# EAGLE board EbookReader (EAGLE 9.7.0)
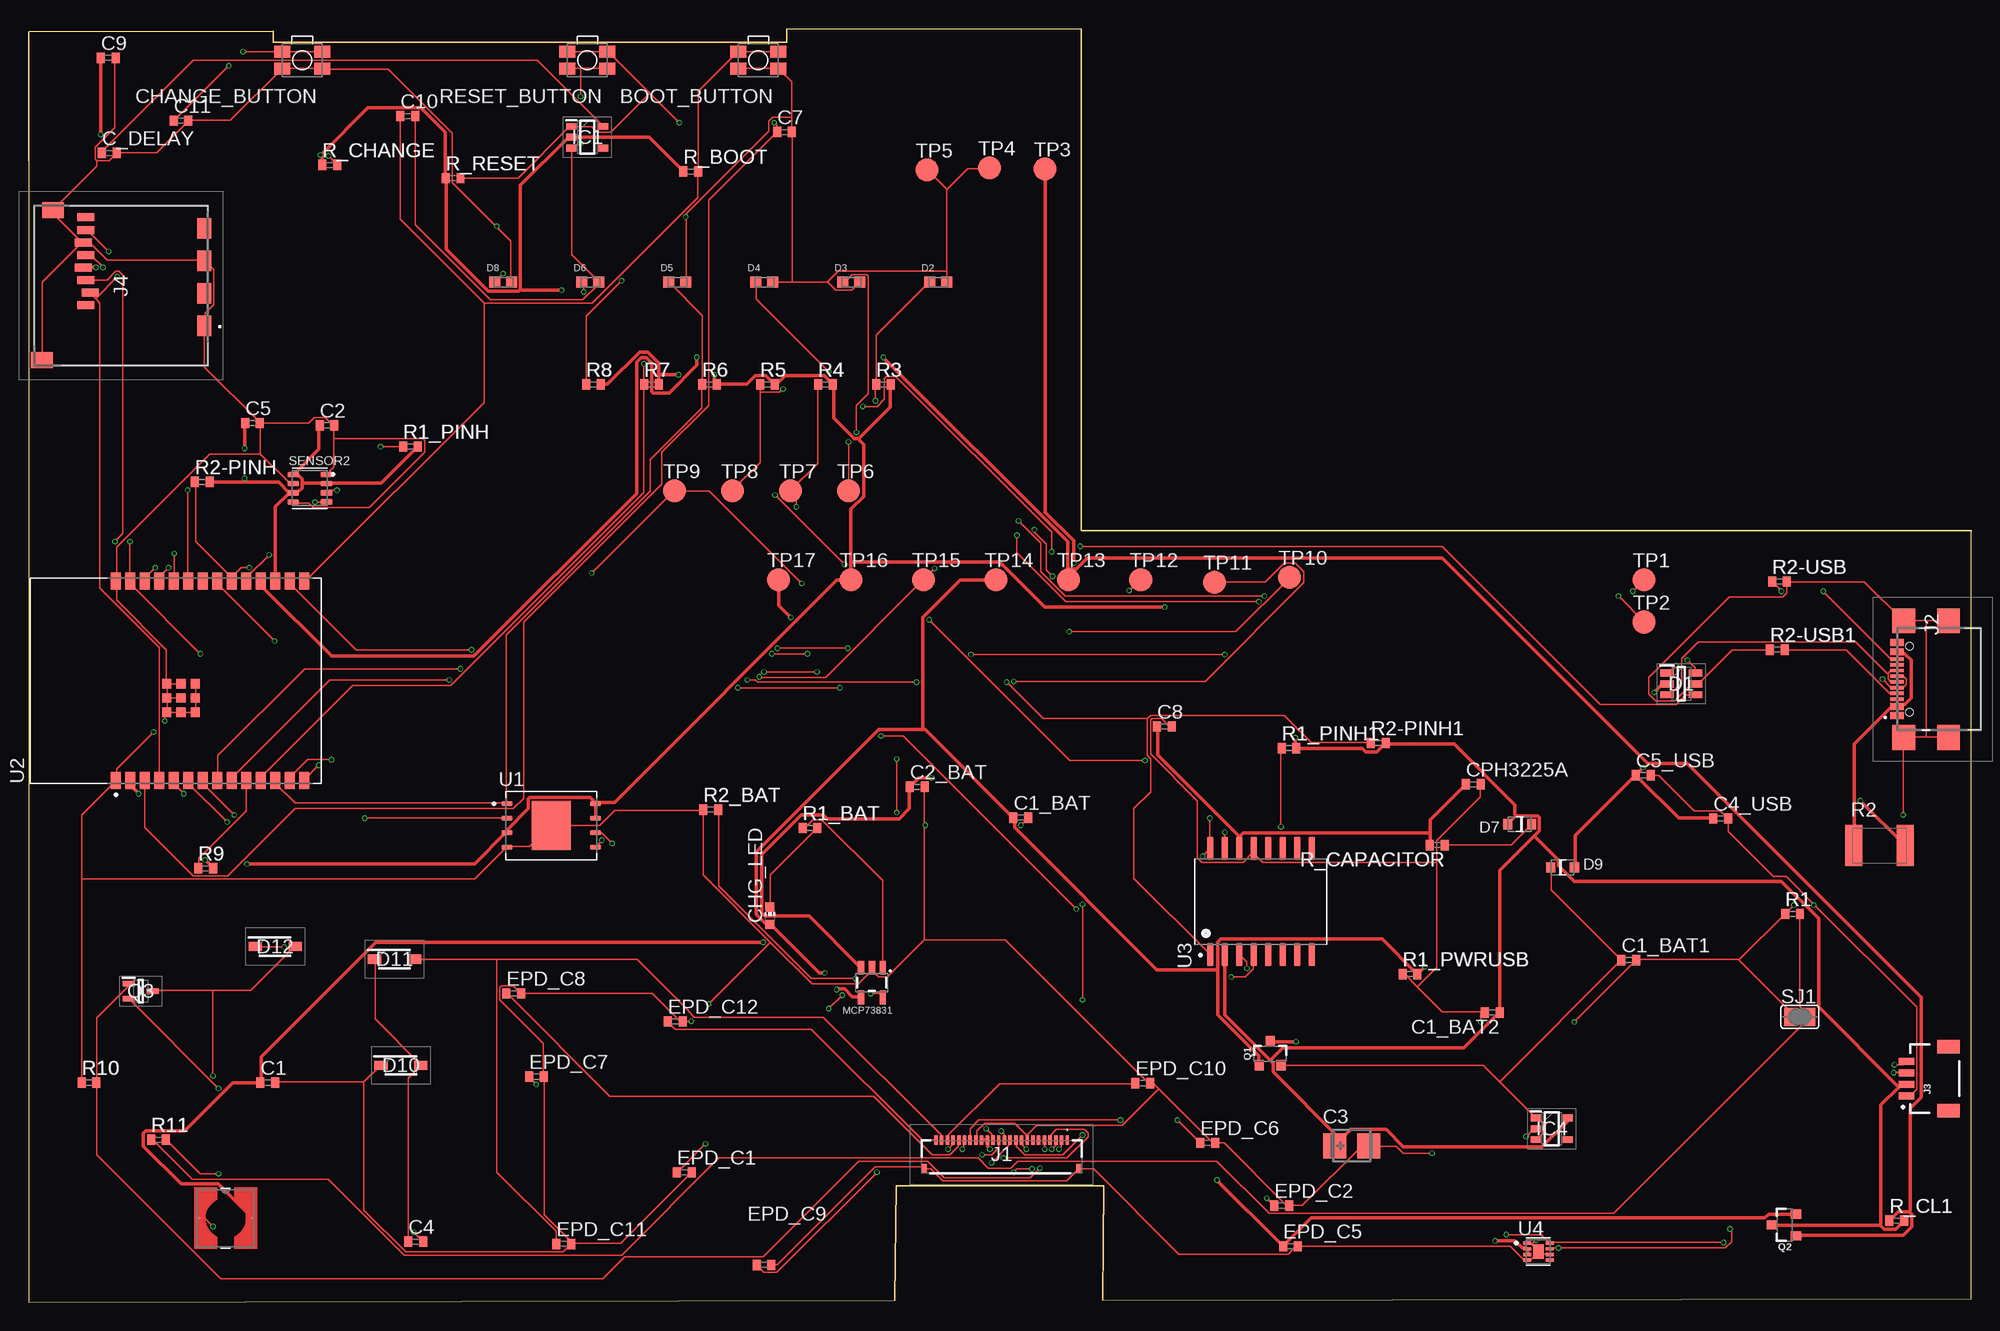
[diagram p1: board, top side]
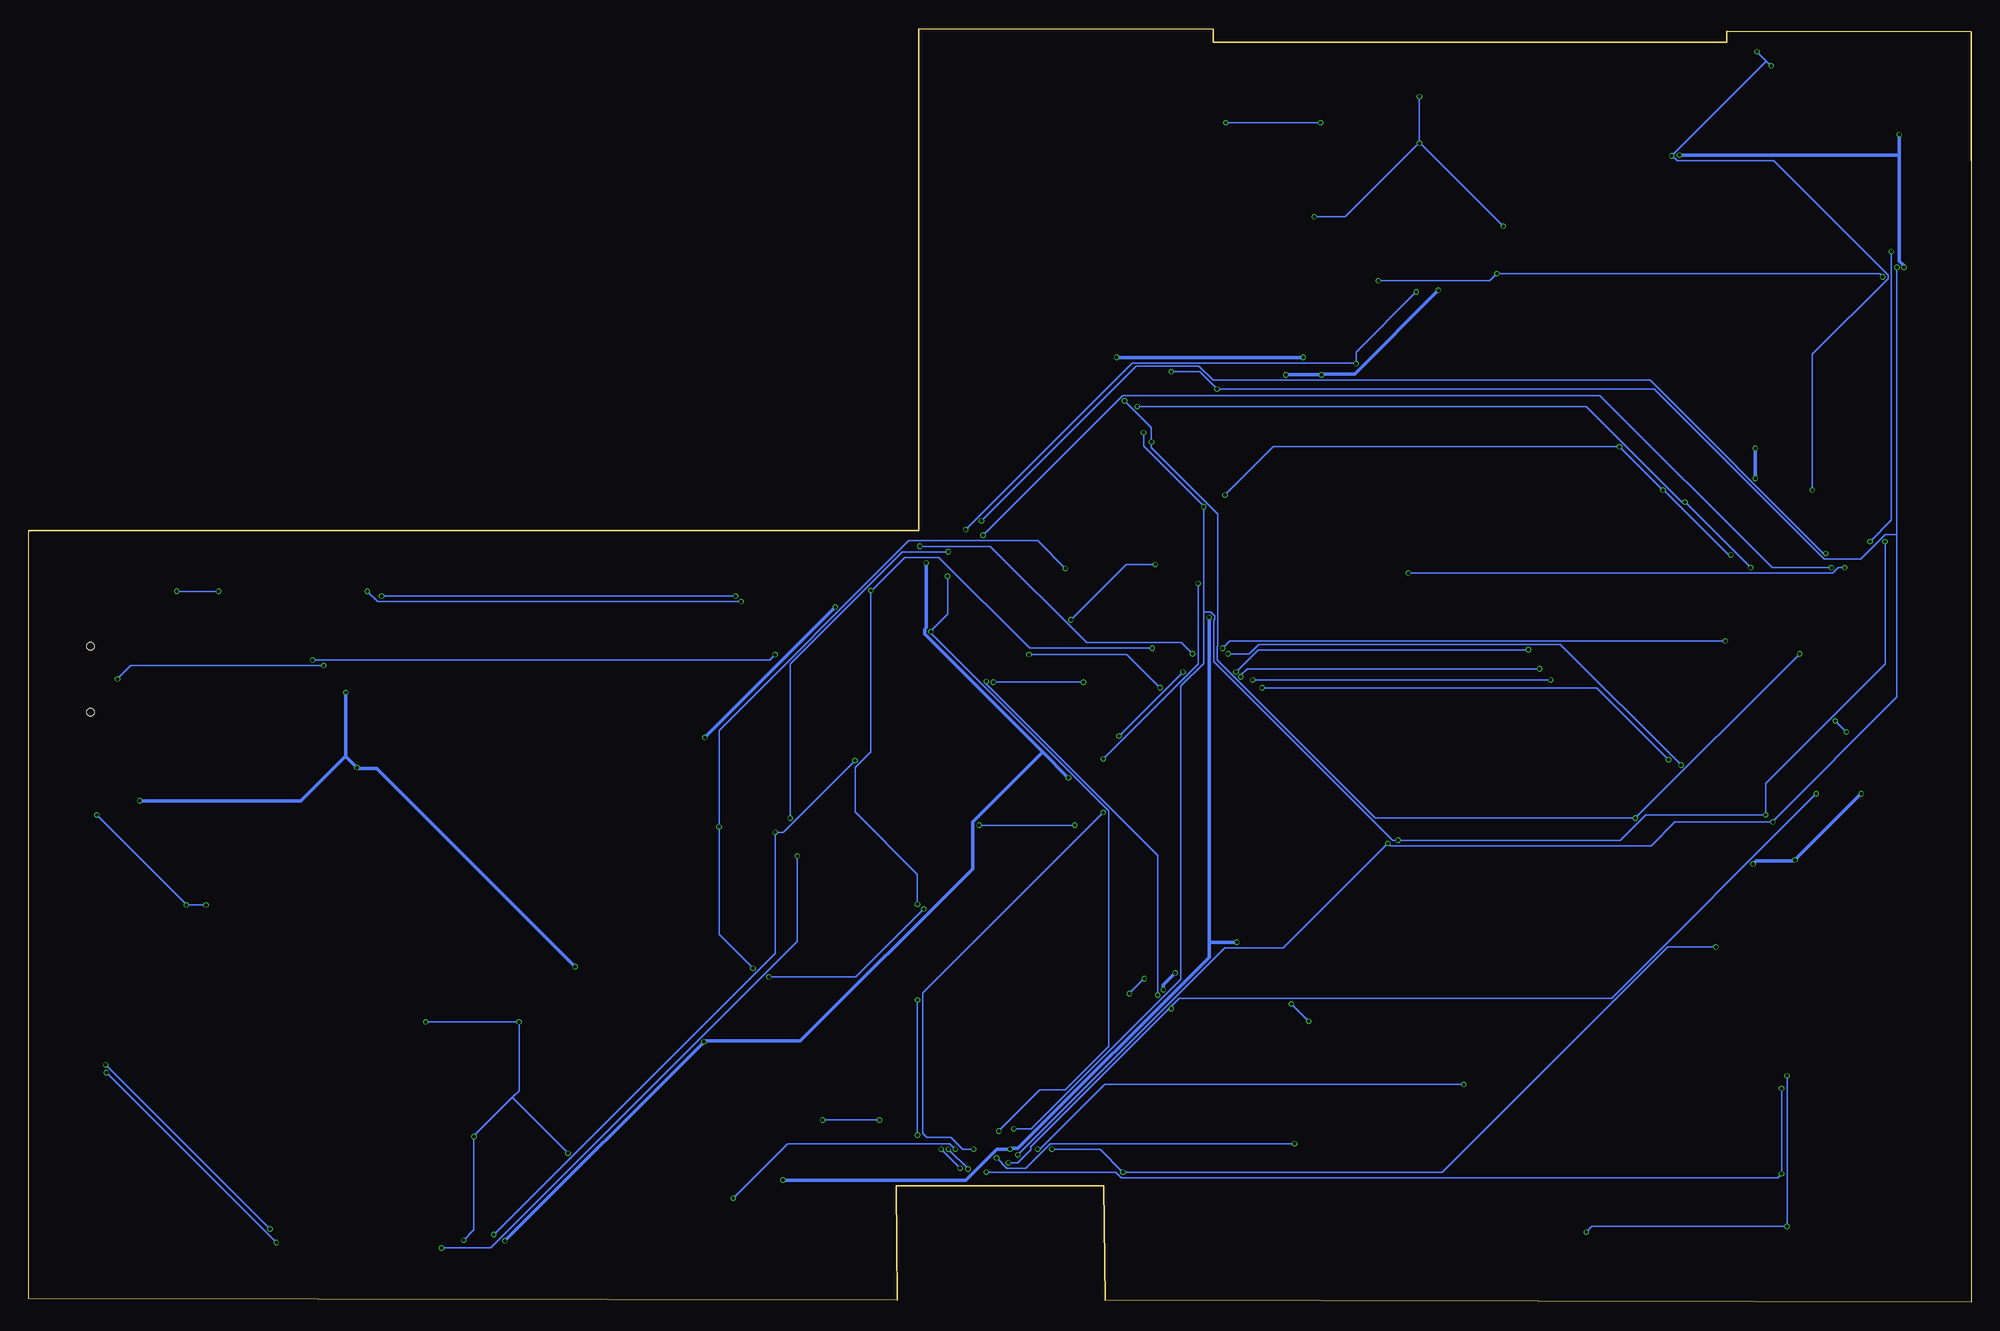
[diagram p2: board, bottom side, seen from below]

Size 170.2 x 111.6 mm. Coordinates in mm from the lower left corner, seen from the top.
Outline: 0,0 75.9,0.13 76,10.2 94.19,10.2 94.09,0.17 170.2,0.3 170.2,67.5 170.2,67.6 92.2,67.6 92.2,111.6 66.41,111.52 66.41,110.4 21.45,110.4 21.45,111.37 0,111.3 0,100 0,0
Copper layers (1*16): Top 0.035mm / dielectric 1.6mm / Bottom 0.035mm
Design rules "jlcpcb-2layers.dru": minimum track width 0.15mm, minimum drill 0.3mm, track to track 5mil, track to pad 5mil, pad to pad 5mil, via to via 5mil, smd to smd 5mil, copper to edge 0.2mm, drill to drill 6mil, minimum pad ring 10mil, minimum via ring 3mil, stop-mask expansion 4mil, vias tented up to drill 0mil, thermal gap 10mil
Net classes: 1 Power: width 0.15 mm

## Footprints (pad centres in the part's own frame; a part is rotated, then mirrored left to right if it is on the bottom)
MYBUTTON = smd 1.4 x 1.05: 1 1.75,0.75; 2 -1.75,0.75; 3 -1.75,-0.75; 4 1.75,-0.75
ESP32_WROVER_EAGLE-LTSPICE_C0402 = smd 0.7 x 0.9: 1 -0.65,0; 2 0.65,0
RCL_CT3528 = smd 2 x 2.2: + -1.5,0; - 1.5,0
EAGLE-LTSPICE_C0402 = smd 0.7 x 0.9: 1 -0.65,0; 2 0.65,0
ADAFRUIT_CHIP-LED0603 = smd 0.8 x 0.8: A 0,-0.75; C 0,0.75
SOT95P280X145-6N = smd 1.2 x 0.6: 1 -1.25,0.95; 2 -1.25,0; 3 -1.25,-0.95; 4 1.25,-0.95; 5 1.25,0; 6 1.25,0.95
DIOC1608X36N = smd 0.97 x 0.94: 1 -0.75,0; 2 0.75,0
ESP32_WROVER_AVX---SD0805S020S1R0_AVX_SD0805S020S1R0_0 = smd 0.8 x 0.9: 1 -1.05,0; 2 1.05,0
SOD3716X135N = smd 1.15 x 0.8: 1 -1.75,0; 2 1.75,0
SOT95P280X125-5N = smd 0.9 x 0.6: 1 -1.4,0.95; 2 -1.4,0; 3 -1.4,-0.95; 4 1.4,-0.95; 5 1.4,0.95
SOT95P280X120-5N = smd 0.9 x 0.6: 1 -1.4,0.95; 2 -1.4,0; 3 -1.4,-0.95; 4 1.4,-0.95; 5 1.4,0.95
FH34SRJ24S05SH99 = smd 0.3 x 0.8: 1 5.75,1.45; 2 5.25,1.45; 3 4.75,1.45; 4 4.25,1.45; 5 3.75,1.45; 6 3.25,1.45; 7 2.75,1.45; 8 2.25,1.45; 9 1.75,1.45; 10 1.25,1.45; 11 0.75,1.45; 12 0.25,1.45; 13 -0.25,1.45; 14 -0.75,1.45; 15 -1.25,1.45; 16 -1.75,1.45; 17 -2.25,1.45; 18 -2.75,1.45; 19 -3.25,1.45; 20 -3.75,1.45; 21 -4.25,1.45; 22 -4.75,1.45; 23 -5.25,1.45; 24 -5.75,1.45 | smd 0.4 x 0.8: MP1 6.75,-1.05; MP2 -6.75,-1.05
SAMACSYS_PARTS_USB4110GFA = smd 0.3 x 1.15: A1 -3.35,3.678; A4 -2.55,3.678; A5 -1.25,3.678; A6 -0.25,3.678; A7 0.25,3.678; A8 1.25,3.678; A9 2.55,3.678; A12 3.35,3.678; B1 3.05,3.678; B4 2.25,3.678; B5 1.75,3.678; B6 0.75,3.678; B7 -0.75,3.678; B8 -1.75,3.678; B9 -2.25,3.678; B12 -3.05,3.678 | smd 2.18 x 2: MP1 -5.11,-0.827; MP2 5.11,-0.827; MP3 -5.11,3.103; MP4 5.11,3.103 | hole 0.65: -2.89,2.603; 2.89,2.603
JST04_1MM_RA = smd 0.6 x 1.35: 1 -1.5,0; 2 -0.5,0; 3 0.5,0; 4 1.5,0 | smd 1.2 x 2: NC1 2.8,-3.675; NC2 -2.8,-3.675
112ATAARR03ATTEND = smd 1.8 x 1.2: G1 10.6,10.4; G2 4.9,10.4; S1 7.75,10.4; S2 2.05,10.4 | smd 1.4 x 1.9: G3 13.6,-3.85; G4 0.45,-2.85 | smd 0.7 x 1.5: P1 8.8,0; P2 7.7,0.4; P3 6.6,0; P4 5.5,-0.2; P5 4.4,0; P6 3.3,-0.2; P7 2.2,0; P8 1.1,0
IND_4828-WE-TPC_WRE = smd 0.127 x 0.127: 1 -2.286,0; 2 2.286,0
ESP32_WROVER_SPARKFUN-IC-POWER_SOT23-5 = smd 0.55 x 1.2: 1 -0.95,-1.3; 2 0,-1.3; 3 0.95,-1.3; 4 0.95,1.3; 5 -0.95,1.3
ESP32_WROVER_SPARKFUN-DISCRETESEMI_SOT23-3 = smd 0.8 x 0.9: 1 -0.95,-1; 2 0.95,-1; 3 0,1.1
SOT65P210X110-3N = smd 1.05 x 0.5: 1 -1.05,0.65; 2 -1.05,-0.65; 3 1.05,0
ESP32_WROVER_EAGLE-LTSPICE_R0402 = smd 0.7 x 0.9: 1 -0.65,0; 2 0.65,0
ESP32C6_VARISTOR_CT/CN1812 = smd 1.5 x 3.6: 1 -2.25,0; 2 2.25,0
ESP32_WROVER_BME680_PSON80P300X300X100-8N = smd 1.016 x 0.5: 1 1.458,1.2; 2 1.458,0.4; 3 1.458,-0.4; 4 1.458,-1.2; 5 -1.458,-1.22; 6 -1.458,-0.4; 7 -1.458,0.4; 8 -1.458,1.2
SJ = smd 1.168 x 1.6: 1 -0.762,0; 2 0.762,0
TP20R = smd 2 x 2: TP 0,0
SON127P600X800X80-9N = smd 0.94 x 0.44: 1 -3.895,1.905; 2 -3.895,0.635; 3 -3.895,-0.635; 4 -3.895,-1.905; 5 3.895,-1.905; 6 3.895,-0.635; 7 3.895,0.635; 8 3.895,1.905 | smd 3.4 x 4.3: 9 0,0
XCVR_ESP32-C6-WROOM-1-N8 = smd 1.5 x 0.9: 1 -8.75,5.26; 2 -8.75,3.99; 3 -8.75,2.72; 4 -8.75,1.45; 5 -8.75,0.18; 6 -8.75,-1.09; 7 -8.75,-2.36; 8 -8.75,-3.63; 9 -8.75,-4.9; 10 -8.75,-6.17; 11 -8.75,-7.44; 12 -8.75,-8.71; 13 -8.75,-9.98; 14 -8.75,-11.25; 15 8.75,-11.25; 16 8.75,-9.98; 17 8.75,-8.71; 18 8.75,-7.44; 19 8.75,-6.17; 20 8.75,-4.9; 21 8.75,-3.63; 22 8.75,-2.36; 23 8.75,-1.09; 24 8.75,0.18; 25 8.75,1.45; 26 8.75,2.72; 27 8.75,3.99; 28 8.75,5.26 | smd 0.8 x 0.8: 29_1 -2.755,0.79; 29_2 -1.505,0.79; 29_3 -0.255,0.79; 29_4 -2.755,-0.46; 29_5 -1.505,-0.46; 29_6 -0.255,-0.46; 29_7 -2.755,-1.71; 29_8 -1.505,-1.71; 29_9 -0.255,-1.71
SOIC127P1032X265-16N = smd 2.05 x 0.59: 1 -4.655,4.445; 2 -4.655,3.175; 3 -4.655,1.905; 4 -4.655,0.635; 5 -4.655,-0.635; 6 -4.655,-1.905; 7 -4.655,-3.175; 8 -4.655,-4.445; 9 4.655,-4.445; 10 4.655,-3.175; 11 4.655,-1.905; 12 4.655,-0.635; 13 4.655,0.635; 14 4.655,1.905; 15 4.655,3.175; 16 4.655,4.445
SON50P200X200X80-9N = smd 0.76 x 0.27: 1 -0.985,0.75; 2 -0.985,0.25; 3 -0.985,-0.25; 4 -0.985,-0.75; 5 0.985,-0.75; 6 0.985,-0.25; 7 0.985,0.25; 8 0.985,0.75 | smd 0.9 x 1.3: 9 0,0

## Placement (x,y rotation side)
BOOT_BUTTON  BUTTON_CUSYOMV1  [MYBUTTON]  63.94,108.83 180 top
C1  10uF  [ESP32_WROVER_EAGLE-LTSPICE_C0402]  20.96,19.23 0 top
C1_BAT  4.7uF  [ESP32_WROVER_EAGLE-LTSPICE_C0402]  86.93,42.45 0 top
C1_BAT1  4.7uF  [ESP32_WROVER_EAGLE-LTSPICE_C0402]  140.18,29.97 0 top
C1_BAT2  4.7uF  [ESP32_WROVER_EAGLE-LTSPICE_C0402]  128.22,25.37 180 top
C2  100nF  [ESP32_WROVER_EAGLE-LTSPICE_C0402]  26.14,76.83 0 top
C2_BAT  4.7uF  [ESP32_WROVER_EAGLE-LTSPICE_C0402]  77.84,45.15 0 top
C3  100uF TANT  [RCL_CT3528]  115.91,13.7 0 top
C4  4.7uF/25V  [ESP32_WROVER_EAGLE-LTSPICE_C0402]  33.91,5.29 0 top
C4_USB  100nF  [ESP32_WROVER_EAGLE-LTSPICE_C0402]  148.23,42.37 0 top
C5  100nF  [ESP32_WROVER_EAGLE-LTSPICE_C0402]  19.62,77.03 0 top
C5_USB  4.7uF  [ESP32_WROVER_EAGLE-LTSPICE_C0402]  141.44,46.17 0 top
C7  1uF  [ESP32_WROVER_EAGLE-LTSPICE_C0402]  66.22,102.53 0 top
C8  100nF  [EAGLE-LTSPICE_C0402]  99.5,50.43 0 top
C9  100nF  [ESP32_WROVER_EAGLE-LTSPICE_C0402]  6.98,109.03 0 top
C10  100nf  [ESP32_WROVER_EAGLE-LTSPICE_C0402]  33.21,103.93 0 top
C11  100nF  [ESP32_WROVER_EAGLE-LTSPICE_C0402]  13.36,103.53 0 top
C_DELAY  100nF  [ESP32_WROVER_EAGLE-LTSPICE_C0402]  7.07,100.69 0 top
CHANGE_BUTTON  BUTTON_CUSYOMV1  [MYBUTTON]  23.98,108.83 180 top
CHG_LED  [ADAFRUIT_CHIP-LED0603]  64.94,33.85 0 top
CPH3225A  [EAGLE-LTSPICE_C0402]  126.55,45.37 0 top
D1  USBLC6-2SC6Y  [SOT95P280X145-6N]  144.78,54.17 0 top
D2  PGB1010603MR  [DIOC1608X36N]  79.68,89.37 0 top
D3  PGB1010603MR  [DIOC1608X36N]  72.06,89.37 0 top
D4  PGB1010603MR  [DIOC1608X36N]  64.44,89.37 0 top
D5  PGB1010603MR  [DIOC1608X36N]  56.82,89.37 0 top
D6  PGB1010603MR  [DIOC1608X36N]  49.2,89.37 0 top
D7  ESP32_WROVER_AVX---SD0805S020S1R0_AVX_SD0805S020S1R0_0_0AVX_SD0805S020S1R0_0_0  [ESP32_WROVER_AVX---SD0805S020S1R0_AVX_SD0805S020S1R0_0]  130.63,41.88 180 top
D8  PGB1010603MR  [DIOC1608X36N]  41.58,89.37 0 top
D9  ESP32_WROVER_AVX---SD0805S020S1R0_AVX_SD0805S020S1R0_0_0AVX_SD0805S020S1R0_0_0  [ESP32_WROVER_AVX---SD0805S020S1R0_AVX_SD0805S020S1R0_0]  134.38,38.08 0 top
D10  MBR0530  [SOD3716X135N]  32.62,20.75 0 top
D11  MBR0530  [SOD3716X135N]  32.06,30.05 0 top
D12  MBR0530  [SOD3716X135N]  21.6,31.15 0 top
EPD_C1  1uF/50V  [EAGLE-LTSPICE_C0402]  57.45,11.37 0 top
EPD_C2  1uF/50V  [EAGLE-LTSPICE_C0402]  109.78,8.45 0 top
EPD_C5  0.1uF/50V  [EAGLE-LTSPICE_C0402]  110.55,4.89 0 top
EPD_C6  1uF/50V  [EAGLE-LTSPICE_C0402]  103.29,13.95 0 top
EPD_C7  1uF/50V  [EAGLE-LTSPICE_C0402]  44.5,19.75 0 top
EPD_C8  1uF/50V  [EAGLE-LTSPICE_C0402]  42.51,27.05 0 top
EPD_C9  1uF/50V  [EAGLE-LTSPICE_C0402]  64.42,3.25 0 top
EPD_C10  1uF/50V  [EAGLE-LTSPICE_C0402]  97.61,19.19 0 top
EPD_C11  1uF/50V  [EAGLE-LTSPICE_C0402]  46.89,5.09 0 top
EPD_C12  1uF/50V  [EAGLE-LTSPICE_C0402]  56.65,24.59 0 top
IC1  BD5229G-TR  [SOT95P280X125-5N]  48.95,102.07 0 top
IC4  XC6220A331MR-G  [SOT95P280X120-5N]  133.43,15.19 0 top
J1  FH34SRJ-24S-0.5SH_99_  [FH34SRJ24S05SH99]  85.24,12.74 0 top
J2  SAMACSYS_PARTS_USB4110-GF-A  [SAMACSYS_PARTS_USB4110GFA]  167.36,54.59 90 top
J3  QWIIC_RIGHT_ANGLE  [JST04_1MM_RA]  164.51,19.58 90 top
J4  112A-TAAR-R03_ATTEND  [112ATAARR03ATTEND]  5,96.15 270 top
L1  68uH  [IND_4828-WE-TPC_WRE]  17.27,7.35 0 top
MCP73831  ESP32_WROVER_SPARKFUN-IC-POWER_MCP73831  [ESP32_WROVER_SPARKFUN-IC-POWER_SOT23-5]  73.88,27.99 180 top
Q1  20V/4.2A/52mΩ/1.4W  [ESP32_WROVER_SPARKFUN-DISCRETESEMI_SOT23-3]  108.76,21.76 0 top
Q2  20V/4.2A/52mΩ/1.4W  [ESP32_WROVER_SPARKFUN-DISCRETESEMI_SOT23-3]  153.83,6.76 90 top
Q3  SI1308EDL-T1-GE3  [SOT65P210X110-3N]  9.83,27.25 0 top
R1  2.2  [ESP32_WROVER_EAGLE-LTSPICE_R0402]  154.53,34.01 0 top
R1_BAT  200  [ESP32_WROVER_EAGLE-LTSPICE_R0402]  68.45,41.55 0 top
R1_PINH  10k  [ESP32_WROVER_EAGLE-LTSPICE_R0402]  33.46,74.97 0 top
R1_PINH1  10k  [ESP32_WROVER_EAGLE-LTSPICE_R0402]  110.42,48.54 0 top
R1_PWRUSB  100k  [ESP32_WROVER_EAGLE-LTSPICE_R0402]  121.01,28.74 0 top
R2  ESP32C6_VARISTORCN1812  [ESP32C6_VARISTOR_CT/CN1812]  162.14,40 0 top
R2-PINH  10k  [ESP32_WROVER_EAGLE-LTSPICE_R0402]  15.22,71.87 0 top
R2-PINH1  10k  [ESP32_WROVER_EAGLE-LTSPICE_R0402]  118.23,48.99 0 top
R2-USB  5K1  [ESP32_WROVER_EAGLE-LTSPICE_R0402]  153.38,63.13 0 top
R2-USB1  5K1  [ESP32_WROVER_EAGLE-LTSPICE_R0402]  153.2,57.17 0 top
R2_BAT  2k  [ESP32_WROVER_EAGLE-LTSPICE_R0402]  59.76,43.15 0 top
R3  10k  [ESP32_WROVER_EAGLE-LTSPICE_R0402]  74.89,80.41 0 top
R4  10k  [ESP32_WROVER_EAGLE-LTSPICE_R0402]  69.81,80.41 0 top
R5  10k  [ESP32_WROVER_EAGLE-LTSPICE_R0402]  64.73,80.41 0 top
R6  10k  [ESP32_WROVER_EAGLE-LTSPICE_R0402]  59.65,80.41 0 top
R7  10k  [ESP32_WROVER_EAGLE-LTSPICE_R0402]  54.57,80.41 0 top
R8  10k  [ESP32_WROVER_EAGLE-LTSPICE_R0402]  49.49,80.41 0 top
R9  10k  [ESP32_WROVER_EAGLE-LTSPICE_R0402]  15.51,38.01 0 top
R10  10k  [ESP32_WROVER_EAGLE-LTSPICE_R0402]  5.3,19.23 0 top
R11  0.47  [ESP32_WROVER_EAGLE-LTSPICE_R0402]  11.38,14.23 0 top
R_BOOT  10k  [ESP32_WROVER_EAGLE-LTSPICE_R0402]  58.01,99.07 0 top
R_CAPACITOR  15  [ESP32_WROVER_EAGLE-LTSPICE_R0402]  123.41,40.04 180 top
R_CHANGE  10k  [ESP32_WROVER_EAGLE-LTSPICE_R0402]  26.38,99.64 0 top
R_CL1  10k  [ESP32_WROVER_EAGLE-LTSPICE_R0402]  163.66,7.13 0 top
R_RESET  10k  [ESP32_WROVER_EAGLE-LTSPICE_R0402]  37.19,98.49 0 top
RESET_BUTTON  BUTTON_CUSYOMV1  [MYBUTTON]  48.95,108.83 180 top
SENSOR2  ESP32_WROVER_BME680_BME680  [ESP32_WROVER_BME680_PSON80P300X300X100-8N]  24.64,71.32 0 top
SJ1  [SJ]  155.16,24.99 0 top
TP1  TPTP20R  [TP20R]  141.51,63.29 0 top
TP2  TPTP20R  [TP20R]  141.53,59.59 0 top
TP3  TPTP20R  [TP20R]  89.05,99.29 0 top
TP4  TPTP20R  [TP20R]  84.17,99.39 0 top
TP5  TPTP20R  [TP20R]  78.69,99.19 0 top
TP6  TPTP20R  [TP20R]  71.81,71.09 0 top
TP7  TPTP20R  [TP20R]  66.73,71.09 0 top
TP8  TPTP20R  [TP20R]  61.65,71.09 0 top
TP9  TPTP20R  [TP20R]  56.57,71.09 0 top
TP10  TPTP20R  [TP20R]  110.48,63.51 0 top
TP11  TPTP20R  [TP20R]  103.89,63.09 0 top
TP12  TPTP20R  [TP20R]  97.43,63.31 0 top
TP13  TPTP20R  [TP20R]  91.08,63.31 0 top
TP14  TPTP20R  [TP20R]  84.73,63.31 0 top
TP15  TPTP20R  [TP20R]  78.38,63.31 0 top
TP16  TPTP20R  [TP20R]  72.03,63.31 0 top
TP17  TPTP20R  [TP20R]  65.68,63.31 0 top
U1  W25Q512JVEIQ  [SON127P600X800X80-9N]  45.79,41.76 0 top
U2  ESP32-C6-WROOM-1-N8  [XCVR_ESP32-C6-WROOM-1-N8]  12.9,54.44 90 top
U3  DS3231SN#  [SOIC127P1032X265-16N]  107.95,35.1 90 top
U4  MAX17048G+T10  [SON50P200X200X80-9N]  132.27,4.42 0 top

## Tracks (layer width: path | path; a pad name or v marks a point on that pad's centre or on a via)
3V3  (via drill 0.3)
  Top 0.3: IC4.5 134.78,16.09 134.78,15.81 132.56,13.6 120.45,13.6 118.92,15.12 115.81,15.12 114.42,13.73 C3.+ 114.84,14.36 109.02,20.18 109.02,20.94 108.78,21.18 | 108.78,21.18 104.8,25.16 104.8,30.42 U3.2 | 162.2,6.74 152.79,6.74 Q2.3 | 162.2,6.74 162.55,6.39 163.59,6.39 164.28,7.09 R_CL1.2 | 163.83,18.82 162.27,17.27 162.27,6.88 162.2,6.74 | 163.83,18.82 164.07,19.07 164.49,19.07 J3.2 | 131.91,40.85 132.36,41.3 132.36,42.47 132.22,42.61 130.28,42.61 | 131.91,40.85 128.89,37.83 128.89,25.44 C1_BAT2.1 128.76,25.3 125.71,22.25 109.85,22.25 108.78,21.18 | 130.28,42.61 129.59,41.92 D7.2 | 130.28,42.61 130.21,42.75 130.21,43.58 124.88,48.91 118.99,48.91 R2-PINH1.2 118.85,48.98 118.09,48.22 117.12,48.22 116.84,48.5 111.1,48.5 R1_PINH1.2 110.96,48.64 v110.96,49.47 | 163.83,18.82 156.8,25.85 156.8,33.61 153.55,36.86 135.4,36.86 134.02,38.25 134.02,38.73 131.91,40.85 | v6.32,102.3 C9.1 | v5.91,90.67 4.87,90.67 J4.P4 | R_BOOT.1 57.36,99.12 54.38,102.1 47.59,102.1 IC1.2 47.46,101.96 47.18,101.96 43.09,97.87 43.09,88.73 | 25.71,100.5 25.71,100.64 29.73,104.66 34.37,104.66 36.52,102.51 36.52,98.5 R_RESET.1 36.58,98.36 36.58,92.26 40.25,88.59 42.95,88.59 43.09,88.73 | 25.71,100.5 25.71,99.67 R_CHANGE.1 | v25.57,100.5 25.71,100.5 | v15.46,38.73 16.16,38.04 R9.2 | v9.65,44.55 8.95,45.24 8.95,45.66 U2.2 | U1.8 49.67,43.72 49.19,44.2 43.92,44.2 43.79,44.07 43.79,43.23 41.92,41.36 41.92,41.16 U1.3 41.78,41.09 39.08,38.39 v19.13,38.39 | U1.7 49.67,42.4 49.67,43.51 U1.8 | 55.21,81.25 55.21,80.42 R7.2 | 55.21,81.25 55.21,82.29 54.24,83.26 53.55,83.26 50.71,80.42 50.16,80.42 R8.2
  Top 0.3: 72.73,75.64 75.5,78.41 75.5,80.35 R3.2 | 72.73,75.64 72.32,75.64 70.52,77.44 70.52,80.28 R4.2 70.45,80.42 69.69,81.18 66.29,81.18 65.53,80.42 R5.2 65.32,80.42 64.56,81.18 63.66,81.18 62.9,80.42 60.34,80.42 R6.2 60.27,80.56 60.06,80.77 v60.06,81.25 | 72.04,64.84 72.04,69.48 73.15,70.59 73.15,75.16 72.8,75.51 72.73,75.64 | 72.04,64.84 TP16.TP 71.9,63.25 70.79,63.25 51.33,43.79 49.81,43.79 U1.8 | v56.94,81.25 55.21,81.25 | v46.69,88.66 43.23,88.66 43.09,88.73 | v99.53,60.89 89.01,60.89 85.06,64.84 72.04,64.84
  Bottom 0.3: 6.32,100.5 6.32,91.22 5.91,90.81 v5.91,90.67 | 6.32,100.5 v6.32,102.3 | v25.57,100.5 6.32,100.5 | v9.65,44.55 v15.46,38.73 15.6,38.66 18.86,38.66 v19.13,38.39 | v60.06,81.25 v56.94,81.25 56.8,81.32 54.03,81.32 v46.69,88.66 | v99.53,60.89 v110.96,49.47
32KHZ  (via drill 0.3)
  Top 0.15: 98.01,51.13 98.29,51.41 109.99,51.41 112.34,49.05 117.54,49.05 R2-PINH1.1 | 98.01,51.13 98.01,47.88 98.29,47.6 98.29,44.69 96.83,43.23 96.83,37.14 103.48,30.49 U3.1 | v36.86,54.52 26.4,54.52 17.82,45.94 17.82,45.73 U2.9 | v62.97,54.52 63.66,54.52 63.87,54.31 v77.79,54.31 | v85.68,54.31 88.87,51.13 98.01,51.13
  Bottom 0.15: v62.97,54.52 v36.86,54.52 | v85.68,54.31 v77.79,54.31
DN  (via drill 0.3)
  Top 0.15: J2.A7 163.73,54.8 164.28,54.8 164.49,54.59 164.49,54.11 164.28,53.9 163.73,53.9 J2.B7 163.66,53.9 163.1,53.9 v162.41,54.59 | v144.34,55.77 143.71,55.15 143.57,55.15 D1.1
  Bottom 0.15: v144.34,55.77 161.23,55.77 v162.41,54.59
DP
  Top 0.15: 162.9,55.08 162.9,54.59 163.1,54.38 163.66,54.38 J2.A6 | 162.9,55.08 163.1,55.28 163.66,55.28 J2.B6 | D1.3 143.57,53.28 143.85,53.28 144.82,54.25 144.82,56.39 146.28,57.85 160.06,57.85 162.83,55.08 162.9,55.08
EPD_3V3  (via drill 0.3)
  Top 0.3: L1.2 19.62,7.36 16.64,10.34 13.39,10.34 10.06,13.67 10.06,14.77 10.27,14.98 13.66,14.98 17.89,19.21 20.24,19.21 C1.1 20.38,19.34 20.38,21.49 30.42,31.53 v64.35,31.53 | J1.16 83.54,14.22 83.95,14.22 J1.15 84.02,14.08 84.02,13.6 v84.23,13.39 | Q2.2 154.79,7.71 152.44,7.71 152.09,7.36 112.34,7.36 109.92,4.94 EPD_C5.1 109.78,5.01 v104.1,10.69 | v66.78,59.99 65.74,61.03 65.74,63.25 TP17.TP
  Bottom 0.3: v104.1,10.69 88.11,10.69 85.41,13.39 v84.23,13.39 84.09,13.46 83.54,13.46 66.78,30.22 66.78,31.53 | 66.78,31.53 v66.78,59.99 | 66.78,31.53 v64.35,31.53
EPD_3V3_C  (via drill 0.3)
  Top 0.3: 164.77,7.92 164.97,7.71 164.97,6.6 164.21,5.84 154.86,5.84 Q2.1 | 164.77,7.92 163.8,7.92 163.03,7.16 R_CL1.1 | v58.54,82.78 58.54,82.08 56.11,79.66 54.73,79.66 54.59,79.8 54.59,82.29 54.1,82.78 53.69,82.78 53.27,82.36 53.27,70.87 39.01,56.6 26.54,56.6 20.38,62.76 20.38,63.18 U2.18 | v74.88,82.78 91.02,66.64 91.02,63.32 TP13.TP 91.15,64.22 91.78,64.22 92.75,65.19 123.84,65.19 141.84,47.18 145.31,47.18 165.8,26.68 165.8,17.96 164.83,16.99 164.83,8.06 164.77,7.92
  Bottom 0.3: v74.88,82.78 v58.54,82.78
EPD_BUSY  (via drill 0.3)
  Top 0.15: v87.41,13.39 87,13.8 87,14.15 J1.9 | v76.06,47.6 v76.06,42.89 | v67.75,62.97 59.64,71.07 56.6,71.07 TP9.TP 56.53,71.07 v49.33,63.87 | v11.1,64.36 10.2,63.46 10.2,63.25 U2.26
  Bottom 0.15: v87.41,13.39 88.38,13.39 89.42,14.43 91.5,14.43 91.85,14.77 91.85,27.1 v76.06,42.89 | v76.06,47.6 67.75,55.91 v67.75,62.97 | v11.1,64.36 11.65,64.36 12.14,63.87 v49.33,63.87
EPD_CS  (via drill 0.3)
  Top 0.15: v53.9,82.22 53.9,80.42 R7.1 53.9,80.35 53.9,70.94 37,54.04 28.41,54.04 20.38,46 20.38,45.73 U2.11 | v48.63,88.52 48.63,89.22 48.5,89.36 D6.1 | v85.2,14.98 85.48,14.7 85.48,14.22 J1.12 | v91.15,58.75 105.77,58.75 110.47,63.46 TP10.TP | v88.11,67.68 88.11,67.47 89.14,66.43 89.14,64.15 v89.7,63.59
  Bottom 0.15: v48.63,88.52 53.9,83.26 v53.9,82.22 53.97,82.29 73.49,82.29 v88.11,67.68 | v85.2,14.98 81.6,18.58 79.38,18.58 75.57,22.39 75.57,43.03 91.15,58.61 v91.15,58.75 91.15,58.82 89.7,60.27 v89.7,63.59
EPD_DC  (via drill 0.3)
  Top 0.15: v84.37,12.21 85.96,13.8 85.96,14.15 J1.11 | v13.59,44.55 12.76,45.38 12.76,45.66 U2.5 | v86.31,54.38 103.06,54.38 111.72,63.04 111.72,64.01 110.96,64.77 109.99,64.77 108.33,63.11 103.89,63.11 TP11.TP | v70.1,25.71 v71.28,26.89
  Bottom 0.15: v84.37,12.21 83.54,12.21 82.43,13.32 82.43,13.6 70.2,25.82 | 70.2,25.82 69.41,26.62 31.53,26.62 v13.59,44.55 | v86.31,54.38 86.31,54.18 71.28,39.15 v71.28,26.89 | 70.2,25.82 v70.1,25.71
EPD_RST  (via drill 0.3)
  Top 0.15: v92.33,14.64 90.6,12.9 87.28,12.9 86.51,13.67 86.51,14.15 J1.10 | v92.33,34.86 v92.33,26.48 | v96.42,62.35 97.39,63.32 TP12.TP | v21.56,57.92 16.57,62.9 16.57,63.18 U2.21 | v71.76,57.29 v65.6,57.29
  Bottom 0.15: v92.33,26.48 v92.33,14.64 | v92.33,34.86 92.33,37.49 97.8,42.96 97.8,46.84 96.42,48.22 v96.42,62.35 96.35,62.35 93.44,65.26 90.46,65.26 82.5,57.29 v71.76,57.29 | v21.56,57.92 64.98,57.92 v65.6,57.29
FLASH_CS
  Top 0.15: D5.1 56.11,89.36 59.02,86.45 59.02,80.42 R6.1 58.95,80.35 58.95,78.34 54.45,73.84 54.45,71.07 41.85,58.47 41.85,43.79 U1.1 41.85,43.72 23.36,43.72 21.63,45.45 21.63,45.66 U2.12
GDR  (via drill 0.3)
  Top 0.15: v90.25,13.39 90.46,13.6 90.46,14.15 J1.2 | v88.59,11.73 87.76,10.9 80.21,10.9 78.76,12.35 72.73,12.35 64.35,3.97 52.23,3.97 50.3,2.03 16.85,2.03 5.98,12.9 5.98,19.21 R10.2 5.98,19.27 5.98,24.88 8.75,27.65 8.75,27.86 Q3.1
  Bottom 0.15: v88.59,11.73 v90.25,13.39
GND  (via drill 0.3)
  Top 0.15: 4.66,37.07 4.66,42.68 7.64,45.66 U2.1 7.71,45.73 7.71,46.7 v10.96,49.95 | 4.66,37.07 4.66,19.27 R10.1 | U2.29_1 12.14,51.68 13.32,51.68 U2.29_4 13.39,51.68 14.56,51.68 U2.29_7 14.63,51.75 14.63,52.93 U2.29_8 14.63,53 14.63,54.18 U2.29_9 | U2.29_2 12.14,52.93 13.32,52.93 U2.29_5 | U2.29_3 12.14,54.18 13.32,54.18 U2.29_6 | U2.29_2 12.14,53 12.14,54.11 U2.29_3 | U2.29_3 12.07,54.25 12.07,57.15 7.71,61.52 7.71,63.18 U2.28 7.71,63.25 7.71,66.16 15.88,74.33 20.31,74.33 | U2.29_1 12.14,51.75 12.14,52.86 U2.29_2 | 20.31,74.33 20.31,77.03 C5.2 | 20.31,74.33 22.87,71.77 23.15,71.77 SENSOR2.7 | 26.75,75.64 26.75,73.15 26.13,72.53 SENSOR2.1 | 26.75,75.64 26.75,76.82 C2.2 26.68,76.82 25.99,77.51 25.02,77.51 24.54,77.03 20.38,77.03 C5.2 | 26.75,75.64 34.58,75.64 34.72,75.51 34.72,74.47 29.87,69.62 24.95,69.62 24.54,70.03 23.22,70.03 SENSOR2.5 | C5.2 20.24,77.1 15.39,81.95 15.39,85.48 J4.G1 15.46,85.62 15.46,86.66 16.23,87.42 16.23,90.46 15.46,91.22 J4.G2 15.39,91.3 6.88,91.3 5.35,92.82 4.87,92.82 J4.P6 | v11.93,50.92 11.93,51.41 12.14,51.61 U2.29_1 | 66.85,103.83 66.85,106.94 65.74,108.05 BOOT_BUTTON.2 65.67,108.12 62.21,108.12 BOOT_BUTTON.1 | 66.85,103.83 66.85,102.58 C7.2 66.92,102.51 66.92,89.36 | 57.64,95.1 57.64,95.38 64.84,102.58 64.84,103.48 65.18,103.83 66.85,103.83 | 57.64,95.1 57.64,89.42 D5.2 | 70.03,89.36 66.92,89.36 | 66.92,89.36 65.25,89.36 D4.2 | 70.03,89.36 70.72,88.66 72.11,88.66 72.8,89.36 D3.2 | 80.42,97.53 80.42,90.33 | 80.42,90.33 80.42,89.42 D2.2 | 80.42,97.53 78.76,99.19 TP5.TP | TP4.TP 84.16,99.33 82.29,99.33 80.49,97.53 80.42,97.53 | 80.42,90.33 70.93,90.33 70.03,89.42 70.03,89.36
  Top 0.15: 5.98,100.02 5.84,100.16 5.84,101.2 7.57,102.93 7.57,109.02 C9.2 | 5.98,100.02 7.08,100.02 7.71,100.64 C_DELAY.2 7.78,100.71 11.24,100.71 14.01,103.48 C11.2 14.08,103.55 17.68,103.55 22.18,108.05 CHANGE_BUTTON.1 22.25,108.12 25.71,108.12 CHANGE_BUTTON.2 25.78,108.05 31.53,108.05 37.14,102.44 37.14,98.08 40.98,94.24 | J4.P6 4.8,92.89 4.66,92.89 2.17,95.38 2.17,95.66 J4.G4 2.17,95.73 5.98,99.53 5.98,100.02 | J4.G3 1.2,82.57 1.2,89.36 4.66,92.82 J4.P6 | 48.36,108.12 50.64,108.12 RESET_BUTTON.2 | 48.36,108.12 47.25,108.12 RESET_BUTTON.1 | C10.2 33.88,103.9 33.88,94.41 40.46,87.83 48.56,87.83 49.95,89.22 49.95,89.36 D6.2 49.95,89.42 47.59,91.78 47.59,101.06 IC1.3 47.66,101.06 48.15,101.54 v48.36,101.54 | v48.36,105.63 48.36,108.12 | 40.98,94.24 42.26,92.96 42.26,89.42 D8.2 | v41.02,94.27 40.98,94.24 | v57.57,95.1 57.64,95.1 | 29.38,19.27 21.63,19.27 C1.2 | 29.38,19.27 30.84,20.73 D10.1 | EPD_C11.2 47.59,5.15 51.89,5.15 58.05,11.31 EPD_C1.2 | 29.38,19.27 29.38,8.06 33.05,4.39 46.83,4.39 47.53,5.08 EPD_C11.2 | EPD_C11.2 47.59,5.22 45.17,7.64 45.17,19.69 EPD_C7.2 45.1,19.76 45.1,22.67 41.29,26.48 41.29,27.59 41.43,27.72 42.47,27.72 43.09,27.1 EPD_C8.2 43.23,27.03 54.66,27.03 57.08,24.61 57.29,24.61 EPD_C12.2 57.36,24.61 v58.05,24.61 | 87.45,14.6 87.48,14.57 87.48,14.22 J1.8 | 87.45,14.6 86.38,15.67 83.74,15.67 83.05,14.98 83.05,14.22 J1.17 | 99.01,18.69 98.56,19.14 98.29,19.14 EPD_C10.2 98.22,19.21 98.08,19.21 85.54,31.74 78.48,31.74 | 99.01,18.69 103.69,14.01 103.89,14.01 EPD_C6.2 103.96,13.94 104.73,13.94 110.2,8.47 110.41,8.47 EPD_C2.2 110.47,8.47 111.58,8.47 116.78,13.67 117.4,13.67 C3.- 117.47,13.67 119.82,13.67 120.45,13.04 v122.94,13.04
  Top 0.15: 87.45,14.6 88.31,15.47 95.79,15.47 99.01,18.69 | 78.48,31.74 78.48,41.78 | 78.48,41.78 78.48,45.1 C2_BAT.2 | 78.48,31.74 75.23,28.48 74.46,28.48 73.91,29.04 73.91,29.25 MCP73831.2 73.84,29.04 72.66,27.86 68.65,27.86 64.98,31.53 | v86.93,41.78 87.55,42.4 C1_BAT.2 | v78.55,41.78 78.48,41.78 | 64.98,31.53 59.09,37.42 59.09,43.03 R2_BAT.1 59.09,43.1 51.33,43.1 50.02,41.78 45.79,41.78 U1.9 45.72,41.71 43.92,39.91 41.92,39.91 U1.4 41.85,39.84 39.08,37.07 4.66,37.07 | 64.98,31.53 v59.58,26.13 | R2-USB1.1 152.51,57.15 149.25,57.15 146.28,54.18 146.07,54.18 D1.5 146,54.11 145.65,54.11 144.2,52.65 142.54,52.65 141.91,53.28 141.91,54.73 148.98,61.79 153.69,61.79 154.03,62.14 154.03,63.04 R2-USB.2 154.03,63.11 160.82,63.11 164.21,59.72 J2.MP4 | J2.B12 163.73,51.48 163.73,51.27 J2.A1 163.73,51.2 163.73,50.02 164.21,49.54 J2.MP3 | 166.22,49.54 164.28,49.54 J2.MP3 | 166.22,49.54 168.16,49.54 J2.MP1 | J2.B1 163.73,57.71 163.73,57.92 J2.A12 163.73,57.98 163.73,59.16 164.21,59.65 J2.MP4 | 166.22,59.72 164.28,59.72 J2.MP4 | 166.22,59.72 168.16,59.72 J2.MP2 | 166.22,59.72 166.22,49.54 | 149.88,30.01 140.88,30.01 C1_BAT1.2 140.81,29.94 v135.4,24.54 | 149.88,30.01 153.82,33.96 R1.1 153.89,34.02 v154.66,34.79 | SJ1.1 154.38,25.02 154.38,25.44 149.88,29.94 149.88,30.01 | C5_USB.2 142.12,46.14 142.81,46.14 145.93,43.03 148.21,43.03 148.84,42.4 C4_USB.2 148.91,42.33 148.91,41.23 152.85,37.28 153.96,37.28 156.42,34.82 | 156.42,34.82 165.39,25.85 165.39,18.65 164.83,18.1 164.56,18.1 J3.1 | v156.39,34.79 156.42,34.82 | v164.21,42.68 164.21,49.47 J2.MP3 | C8.2 100.09,50.44 99.95,50.44 99.26,51.13 98.42,51.13 98.29,50.99 98.29,48.01 102.37,43.93 102.37,38.94 102.79,38.53 106.39,38.53 107.29,39.43 107.29,39.7 U3.13 107.29,39.36 108.12,38.53 123.35,38.53
  Top 0.15: 121.66,27.62 123.84,25.44 127.51,25.44 C1_BAT2.2 127.23,25.37 v127.23,24.54 | 121.66,27.62 120.59,28.69 120.38,28.69 R1_PWRUSB.1 | 123.35,38.53 123.35,29.32 121.66,27.62 | 123.35,38.53 123.35,40.46 127.16,44.27 127.16,45.31 CPH3225A.2 | U4.9 132.29,4.39 131.59,3.69 131.32,3.69 U4.4 131.25,3.69 130.97,3.69 129.79,4.87 111.24,4.87 EPD_C5.2 111.17,4.87 111.03,4.87 110.34,4.18 100.78,4.18 93.3,11.66 92.05,11.66 J1.MP1 91.98,11.66 90.95,10.62 80.07,10.62 79.03,11.66 78.55,11.66 J1.MP2 78.48,11.73 78.34,11.87 74.19,11.87 65.6,3.28 65.11,3.28 EPD_C9.2 | 131.7,5.04 132.29,4.46 U4.9 | 131.7,5.04 131.59,5.15 131.32,5.15 U4.1 | U4.6 133.19,4.18 132.56,4.18 132.36,4.39 U4.9 | v131.18,14.5 131.87,15.19 132.01,15.19 IC4.2 | 131.7,5.04 v132.08,5.42
  Bottom 0.15: v11.93,50.92 v10.96,49.95 | v48.36,101.54 v48.36,105.63 | v41.02,94.27 48.29,101.54 v48.36,101.54 | v57.57,95.1 54.87,95.1 48.43,101.54 v48.36,101.54 | v78.55,41.78 v86.93,41.78 | v59.58,26.13 v58.05,24.61 | v154.66,34.79 v156.39,34.79 156.39,34.86 v164.21,42.68 | v132.08,5.42 131.18,6.33 v131.18,14.5 131.18,14.57 127.82,17.92 | 127.82,17.92 127.23,18.51 v127.23,24.54 v135.4,24.54 | 127.82,17.92 v122.94,13.04
GPIO8
  Top 0.15: R9.1 14.91,38.04 14.91,38.87 19.06,43.03 19.06,45.66 U2.10
I2C_PW  (via drill 0.3)
  Top 0.3: R1_PINH.2 34.09,74.95 30.91,71.77 26.13,71.77 SENSOR2.2 25.99,71.77 23.98,71.77 | C2.1 25.43,76.82 25.43,74.74 23.22,72.53 SENSOR2.8 23.5,72.6 23.98,72.11 23.98,71.77 | 18.93,71.83 21.9,71.83 22.8,70.94 23.15,70.94 SENSOR2.6 | 18.93,71.83 15.88,71.83 R2-PINH.2 | v18.93,74.81 18.93,77.03 C5.1 | 18.93,71.83 v18.93,72.18 | U2.17 21.63,63.25 21.63,69.69 22.73,70.8 SENSOR2.6 | 23.98,71.77 23.98,71.35 23.63,71 23.29,71 SENSOR2.6
  Bottom 0.3: v18.93,72.18 v18.93,74.81
INT_RTC  (via drill 0.3)
  Top 0.15: v109.71,41.64 109.71,48.5 R1_PINH1.1 | v106.73,29.25 106.73,29.8 106.11,30.42 U3.3 | v37.83,55.49 24.19,55.49 16.57,47.88 16.57,45.73 U2.8 | v64.01,54.8 64.22,54.8 64.28,54.73 69.82,54.73 78.34,63.25 TP15.TP 78.41,63.32 v79.38,64.29
  Bottom 0.15: v106.73,29.25 109.71,32.22 v109.71,41.64 109.71,50.09 93.09,66.71 81.81,66.71 v79.38,64.29 | v37.83,55.49 63.45,55.49 64.01,54.94 v64.01,54.8
IO/BOOT
  Top 0.15: BOOT_BUTTON.3 65.67,109.58 62.21,109.58 BOOT_BUTTON.4 62.14,109.58 58.67,106.11 58.67,99.12 R_BOOT.2 58.61,99.05 58.61,96.77 49.4,87.55 39.91,87.55 | 39.91,87.55 32.57,94.9 32.57,103.9 C10.1 | 39.91,87.55 39.91,78.83 24.33,63.25 24.19,63.25 U2.15
IO/CHANGE  (via drill 0.3)
  Top 0.15: v17.54,108.33 12.76,103.55 C11.1 | v18.79,109.58 22.18,109.58 CHANGE_BUTTON.4 22.25,109.58 25.71,109.58 CHANGE_BUTTON.3 | v26.27,100.44 27.03,99.67 R_CHANGE.2 | v13.94,71.14 13.94,63.25 U2.23
  Bottom 0.15: v18.79,109.58 17.96,108.74 | 17.96,108.74 v17.54,108.33 | 17.96,108.74 v26.27,100.44 26.2,100.44 25.78,100.02 17.33,100.02 7.29,89.98 7.29,89.7 13.94,83.05 v13.94,71.14
MISO  (via drill 0.3)
  Top 0.15: D2.1 78.9,89.36 74.26,84.72 74.26,80.42 R3.1 74.19,80.35 v74.19,78.97 | v71.83,75.37 71.83,71.14 TP6.TP | v29.45,42.4 41.85,42.4 U1.2 | v15.05,56.81 8.95,62.9 8.95,63.18 U2.27 8.88,63.25 v8.88,66.64 | v7.01,92.06 5.14,93.93 5.01,93.93 J4.P7
  Bottom 0.15: v74.19,78.97 71.83,76.61 v71.83,75.37 71.83,74.88 66.02,69.06 66.02,57.5 66.08,57.43 66.08,56.25 52.23,42.4 v29.45,42.4 v15.05,56.81 | v7.01,92.06 7.01,68.51 v8.88,66.64
MOSI  (via drill 0.3)
  Top 0.15: v83.88,15.19 84.44,14.64 84.44,14.22 J1.14 | v67.26,69.69 67.26,70.59 66.78,71.07 TP7.TP 66.78,71.14 69.13,73.5 69.13,80.35 R4.1 | v50.23,40.46 50.23,40.4 49.74,39.91 U1.5 | v72.53,76.2 72.53,78.55 73.56,79.59 73.56,89.91 73.42,90.05 72.18,90.05 71.55,89.42 71.35,89.42 D3.1 | v18.02,42.68 15.32,45.38 15.32,45.66 U2.7 | v7.57,66.64 8.26,67.33 8.26,89.98 7.91,90.33 7.64,90.33 6.88,89.56 5.01,89.56 J4.P3
  Bottom 0.15: v83.88,15.19 82.36,15.19 69.27,28.28 69.27,53.97 67.26,55.98 67.26,60.48 | 67.26,60.48 v67.26,69.69 67.26,69.76 72.53,75.02 v72.53,76.2 | 67.26,60.48 66.64,60.48 66.29,60.13 66.29,59.85 66.36,59.79 66.36,56.12 50.71,40.46 v50.23,40.46 30.77,40.46 28.55,42.68 v18.02,42.68 18.02,45.45 7.57,55.91 v7.57,66.64
N$1
  Top 0.15: R2-USB1.2 153.89,57.15 159.23,57.15 163.03,53.34 163.66,53.34 J2.A5
N$2
  Top 0.15: J1.24 79.45,14.22 78.27,14.22 68.58,23.91 56.67,23.91 56.04,24.54 EPD_C12.1
N$3
  Top 0.15: R_CAPACITOR.1 124.12,40.05 129.86,40.05 131.66,41.85 D7.1
N$4
  Top 0.15: J1.22 80.56,14.22 80.56,14.64 85.06,19.14 96.9,19.14 EPD_C10.1
N$5
  Top 0.15: J1.20 81.46,14.15 81.46,13.67 80.7,12.9 79.17,12.9 74.05,18.03 50.92,18.03 41.92,27.03 EPD_C8.1
N$6  (via drill 0.3)
  Top 0.15: v72.46,28.35 68.58,28.35 60.48,36.45 60.48,43.1 R2_BAT.2 | v73.77,27.03 74.53,27.03 74.81,26.75 MCP73831.5
  Bottom 0.15: v73.77,27.03 v72.46,28.35
N$7  (via drill 0.3)
  Top 0.15: v81.81,13.39 81.94,13.53 81.94,14.15 J1.19 | v44.48,19.07 43.86,19.69 EPD_C7.1
  Bottom 0.15: v81.81,13.39 81.6,13.39 75.92,19.07 v44.48,19.07
N$8  (via drill 0.3)
  Top 0.15: v95.65,15.95 83.26,15.95 82.5,15.19 82.5,14.22 J1.18 | v100.64,15.95 102.58,14.01 EPD_C6.1
  Bottom 0.15: v100.64,15.95 v95.65,15.95
N$9  (via drill 0.3)
  Top 0.15: v153.55,62.28 153.55,62.35 152.79,63.11 R2-USB.1 | v157.22,62.28 163.1,56.39 163.66,56.39 J2.B5
  Bottom 0.15: v157.22,62.28 v153.55,62.28
N$10
  Top 0.15: R1_BAT.1 67.82,41.57 68.02,41.57 68.72,42.27 69.48,42.27 74.81,36.93 74.81,29.32 MCP73831.1
N$11  (via drill 0.3)
  Top 0.15: v89.01,13.39 89.01,14.15 J1.5 | v108.47,9.1 109.09,8.47 EPD_C2.1
  Bottom 0.15: v89.01,13.39 89.49,13.87 103.69,13.87 v108.47,9.1
N$12  (via drill 0.3)
  Top 0.15: v85.41,12.63 90.95,12.63 92.81,14.5 92.81,14.77 92.47,15.12 90.05,15.12 89.49,14.57 89.49,14.22 J1.4 | v59.3,13.87 EPD_C1.1
  Bottom 0.15: v85.41,12.63 84.51,11.73 82.84,11.73 80.7,13.87 v59.3,13.87
N$13
  Top 0.15: C4.1 33.26,5.35 33.26,19.62 34.37,20.73 D10.2 34.37,20.8 30.35,24.82 30.35,30.01 D11.1
N$14
  Top 0.15: CHG_LED.C 64.98,34.65 64.98,37.42 69.06,41.5 R1_BAT.2
N$15
  Top 0.15: C_DELAY.1 6.46,100.71 6.46,100.85 14.42,108.81 44.55,108.81 50.3,103.07 IC1.5
N$16
  Top 0.15: D9.1 133.4,38.04 133.4,36.1 139.49,30.01 C1_BAT1.1 139.49,29.94 128.86,19.31 | IC4.3 132.08,14.29 132.22,14.29 132.7,14.77 132.7,15.6 132.22,16.09 132.08,16.09 IC4.1 132.01,16.16 128.86,19.31 | 128.86,19.31 127.44,20.73 109.71,20.73 Q1.2
PREVGH  (via drill 0.3)
  Top 0.15: v80.56,13.39 80.97,13.8 80.97,14.15 J1.21 | v74.33,11.38 65.53,2.58 64.42,2.58 63.8,3.21 EPD_C9.1 | v22.39,31.12 19.89,31.12 D12.1
  Bottom 0.15: v80.56,13.39 76.33,13.39 v74.33,11.38 46.35,11.38 26.61,31.12 v22.39,31.12
PREVGL
  Top 0.15: 41.02,30.01 33.81,30.01 D11.2 | 41.02,30.01 53.34,30.01 57.78,25.58 57.78,25.51 58.33,24.95 69.62,24.95 79.94,14.64 79.94,14.22 J1.23 | 41.02,30.01 41.02,11.38 46.21,6.19 46.21,5.15 EPD_C11.1
RESE  (via drill 0.3)
  Top 0.15: v89.63,13.39 89.98,13.73 89.98,14.15 J1.3 | v87.9,11.66 86.58,11.66 v86.31,11.38 | v16.64,11.24 15.05,11.24 12.07,14.22 R11.2 | v16.64,18.72 8.81,26.55 Q3.2
  Bottom 0.15: v87.9,11.66 v89.63,13.39 | v86.31,11.38 74.95,11.38 74.46,10.9 16.99,10.9 v16.64,11.24 v16.64,18.72
RESE'
  Top 0.15: R11.1 10.75,14.22 10.89,14.22 14.36,10.76 26.27,10.76 32.91,4.11 51.96,4.11 60.48,12.63 83.19,12.63 84.09,11.73 86.03,11.73 86.65,12.35 104.1,12.35 108.67,7.78 138.87,7.78 155.9,24.82 155.9,24.95 SJ1.2 155.9,25.02 155.9,25.16 155.14,25.92 155.14,33.96 R1.2
RESET  (via drill 0.3)
  Top 0.15: R_RESET.2 37.9,98.5 42.89,98.5 47.39,103 47.53,103 IC1.1 47.59,103 49.33,103 49.81,102.51 50.99,102.51 54.42,105.94 | v65.32,103.34 65.53,103.14 65.53,102.58 C7.1 65.53,102.51 59.58,96.56 59.58,78.55 55.49,74.47 55.49,71.7 43.37,59.58 43.37,44.13 42.47,43.23 23.36,43.23 17.47,37.35 14.42,37.35 10.2,41.57 10.2,45.66 U2.3 | 54.42,105.94 50.71,109.65 RESET_BUTTON.3 50.64,109.58 47.25,109.58 RESET_BUTTON.4 | 54.42,105.94 v57.01,103.34
  Bottom 0.15: v57.01,103.34 v65.32,103.34
RTC_RST  (via drill 0.3)
  Top 0.15: v38.8,57.15 28.69,57.15 22.94,62.9 22.94,63.18 U2.16 | v69.06,55.21 v64.42,55.21 | v74.67,49.61 76.61,49.61 v91.78,34.44 | v105.35,28.48 106.6,28.48 107.29,29.18 107.29,30.42 U3.4
  Bottom 0.15: v38.8,57.15 62.48,57.15 v64.42,55.21 | v74.67,49.61 v69.06,55.21 | v91.78,34.44 97.73,28.48 v105.35,28.48
RX  (via drill 0.3)
  Top 0.15: v12.76,65.6 12.76,63.25 U2.24 | v86.72,68.44 88.66,66.5 88.66,64.01 90.81,61.86 v108.26,61.86 | v139.28,61.86 141.5,59.65 TP2.TP
  Bottom 0.15: v12.76,65.6 12.97,65.6 28.14,80.77 66.43,80.77 67.68,82.02 73.15,82.02 v86.72,68.44 | v139.28,61.86 v108.26,61.86
SCK  (via drill 0.3)
  Top 0.15: 64.08,79.73 64.08,73.57 61.65,71.14 TP8.TP | 64.08,79.73 64.08,80.35 R5.1 | v70.1,81.53 63.73,87.9 63.73,89.36 D4.1 | v66.08,80.01 65.81,79.73 64.08,79.73 | J1.13 84.99,13.53 84.37,12.9 v83.54,12.9 | v51.13,40.19 50.23,41.09 49.74,41.09 U1.6 | v17.4,42.06 14.01,45.45 14.01,45.66 U2.6 | v6.53,90.67 5.49,91.71 5.01,91.71 J4.P5
  Bottom 0.15: v70.1,81.53 67.61,81.53 v66.08,80.01 27.79,80.01 12.9,65.12 9.71,65.12 7.57,67.27 6.53,67.27 | v83.54,12.9 65.39,31.05 60.27,31.05 v51.13,40.19 51.06,40.19 50.85,39.98 28.07,39.98 25.99,42.06 v17.4,42.06 17.4,42.13 6.53,53 6.53,67.27 | 6.53,67.27 v6.53,90.67
SCL  (via drill 0.3)
  Top 0.15: R2-PINH.1 14.63,71.83 14.63,66.64 17.75,63.52 17.75,63.25 U2.20 17.82,63.52 18.65,64.36 v19.34,64.36 | v25.09,70.1 26.06,70.1 SENSOR2.4 | v149.05,6.39 149.19,6.25 149.19,5.29 148.63,4.73 v134.02,4.73 133.26,4.73 U4.7 | v163.45,20.8 164.21,20.8 164.49,21.07 J3.4 | v102.86,39.08 103.48,39.7 U3.16 103.48,39.77 v103.48,42.4 | v73.08,78.48 74.33,78.48 74.95,79.11 74.95,80.91 75.16,81.11 75.99,81.11 89.63,67.47 v89.63,65.74
  Bottom 0.15: v19.34,64.36 v25.09,70.1 25.37,70.1 33.75,78.48 v73.08,78.48 | v163.45,20.8 v149.05,6.39 | v102.86,39.08 102.86,31.6 129.72,4.73 v134.02,4.73 | v89.63,65.74 93.65,65.74 103.48,55.91 v103.48,42.4
SDA  (via drill 0.3)
  Top 0.15: v30.84,74.95 32.78,74.95 R1_PINH.1 | v27.03,71.14 26.34,71.14 26.13,70.94 SENSOR2.3 | v21.07,65.46 19.13,63.52 19.13,63.25 U2.19 | v148.49,5.22 133.26,5.22 U4.8 133.19,5.22 132.5,5.91 v129.45,5.91 | v163.38,20.11 164.49,20.11 J3.3 | v104.8,41.16 104.8,39.77 U3.15 | v71.49,64.63 v65.39,70.73 | v78.9,59.79 91.22,47.46 v97.8,47.46
  Bottom 0.15: v21.07,65.46 21.28,65.46 26.96,71.14 v27.03,71.14 v30.84,74.95 61.17,74.95 v65.39,70.73 | v163.38,20.11 v148.49,5.22 | v129.45,5.91 104.8,30.56 v104.8,41.16 104.1,41.16 v97.8,47.46 | v71.49,64.63 74.05,64.63 v78.9,59.79
SRC  (via drill 0.3)
  Top 0.15: 16.16,27.31 19.48,27.31 23.29,31.12 D12.2 | 16.16,27.31 10.89,27.31 Q3.3 | v33.75,6.12 34.51,5.35 C4.2 | v16.16,6.62 15.42,7.35 L1.1 | v16.16,19.83 16.16,27.31
  Bottom 0.15: v33.75,6.12 33.25,6.62 v16.16,6.62 v16.16,19.83
SS_SD  (via drill 0.3)
  Top 0.15: v51.96,89.49 48.84,86.38 48.84,80.42 R8.1 | v41.57,90.12 40.88,89.42 D8.1 | 5.87,87.94 5.42,88.39 J4.P2 | 5.87,87.94 6.25,87.55 6.25,62.56 11.45,57.36 11.45,45.73 U2.4 | 5.87,87.94 v7.78,89.84
  Bottom 0.15: v51.96,89.49 42.19,89.49 v41.57,90.12 8.05,90.12 v7.78,89.84
TX  (via drill 0.3)
  Top 0.15: v12.28,64.36 11.52,63.59 11.52,63.25 U2.25 | v86.58,67.19 86.58,65.67 90.88,61.38 v107.77,61.38 | v140.53,62.28 141.5,63.25 TP1.TP
  Bottom 0.15: v12.28,64.36 17.47,64.36 32.57,79.45 74.33,79.45 v86.58,67.19 | v107.77,61.38 139.63,61.38 v140.53,62.28
USB_D+  (via drill 0.3)
  Top 0.15: v92.12,66.23 123.84,66.23 137.69,52.38 144.34,52.38 145.17,53.21 146,53.21 D1.4 | v65.11,56.81 v68.23,56.81 | v25.43,47.04 24.12,45.73 U2.14
  Bottom 0.15: v92.12,66.23 85.96,66.23 77.51,57.78 69.2,57.78 v68.23,56.81 | v65.11,56.81 63.25,56.81 62.42,57.64 36.03,57.64 v25.43,47.04
USB_D-  (via drill 0.3)
  Top 0.15: v145.31,56.25 146,55.56 146,55.15 D1.6 | v82.57,56.74 v104.8,56.74 | v62.14,53.83 v71.07,53.83 | v26.54,47.53 24.46,47.53 22.94,46 22.94,45.73 U2.13
  Bottom 0.15: v145.31,56.25 105.28,56.25 v104.8,56.74 | v82.57,56.74 73.98,56.74 v71.07,53.83 | v62.14,53.83 32.84,53.83 v26.54,47.53
VBAT  (via drill 0.3)
  Top 0.3: U4.3 131.32,4.18 131.32,4.66 U4.2 131.18,4.73 130.83,4.73 130.21,5.35 v128.48,5.35 | v111.03,22.81 108.81,22.81 Q1.3 | MCP73831.3 72.87,29.32 68.37,33.82 64.49,33.82 64.22,34.09 64.22,39.22 67.68,42.68 69.62,42.68 69.96,42.33 76.26,42.33 77.17,43.23 77.17,45.1 C2_BAT.1 77.3,45.24 78,45.94 v79.1,45.94 | v91.57,64.77 91.57,66.71 89.08,69.2 89.08,99.26 TP3.TP
  Bottom 0.3: v128.48,5.35 v111.03,22.81 110.89,22.88 102.58,22.88 87.48,37.97 87.48,42.06 81.35,48.19 | v91.57,64.77 91.57,59.09 91.71,58.95 91.71,58.54 81.35,48.19 | v79.1,45.94 81.35,48.19
VBUS  (via drill 0.3)
  Top 0.3: D9.2 135.47,38.11 135.47,40.88 140.74,46.14 C5_USB.1 | C4_USB.1 147.52,42.4 144.54,42.4 140.88,46.07 C5_USB.1 | v142.4,53.41 143.09,54.11 143.51,54.11 D1.2 | v141.43,46.84 140.88,46.28 C5_USB.1 | v160.47,43.93 164.35,40.05 R2.2 | 104.17,29.11 104.17,31.53 104.45,31.81 118.58,31.81 121.62,28.76 R1_PWRUSB.2 121.76,28.83 v122.32,29.39 | 104.17,29.11 104.17,25.16 107.77,21.56 107.77,20.8 Q1.1 | 78.34,50.16 78.55,50.16 86.24,42.47 C1_BAT.1 86.38,42.33 86.38,41.57 98.84,29.11 104.17,29.11 | 78.34,50.16 74.46,50.16 63.73,39.43 63.73,33.96 64.56,33.12 64.91,33.12 CHG_LED.A 65.05,33.05 69.27,28.83 v69.75,28.83 | v70.79,27.38 70.86,27.45 71.49,27.45 72.18,26.75 72.87,26.75 MCP73831.4 | 78.34,50.16 78.34,59.99 81.6,63.25 84.71,63.25 TP14.TP
  Bottom 0.3: 142.4,47.8 v142.4,53.41 | 142.4,47.8 v141.43,46.84 141.29,46.77 139.7,46.77 v122.32,29.39 | v160.47,43.93 146.34,43.93 142.54,47.74 142.4,47.8 | v70.79,27.38 70.79,27.79 v69.75,28.83
VRTC
  Top 0.3: 122.8,41.09 122.8,42.27 125.85,45.31 CPH3225A.1 | 122.8,41.09 122.8,40.05 R_CAPACITOR.2 | 106.04,40.81 98.91,47.94 98.91,50.37 C8.1 | 106.04,40.81 106.04,39.77 U3.14 | 122.8,41.09 106.39,41.09 106.18,40.88 106.04,40.81
VUSB
  Top 0.3: J2.A9 163.73,57.08 163.73,56.88 J2.B4 163.87,56.81 164.35,56.81 164.9,56.25 164.9,52.93 164.35,52.38 163.87,52.38 J2.B9 163.73,52.31 163.73,52.1 J2.A4 163.59,52.03 163.03,52.03 159.92,48.91 159.92,40.05 R2.1